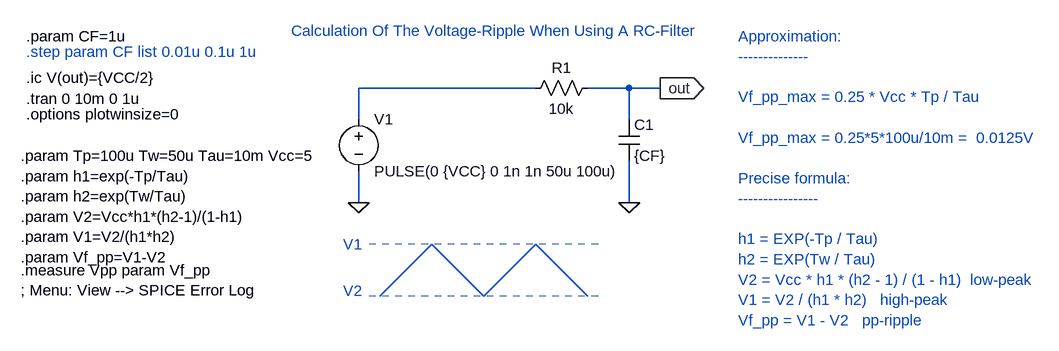
[diagram p0: schematic pwm_RC_filter.asc]
pwm_RC_filter.asc, the LTspice schematic file:
Version 4
SHEET 1 1608 680
WIRE 352 80 80 80
WIRE 496 80 432 80
WIRE 544 80 496 80
WIRE 80 128 80 80
WIRE 496 128 496 80
WIRE 80 256 80 208
WIRE 496 256 496 192
FLAG 496 256 0
FLAG 80 256 0
FLAG 544 80 out
IOPIN 544 80 Out
SYMBOL res 336 96 R270
WINDOW 0 32 56 VTop 0
WINDOW 3 0 56 VBottom 0
SYMATTR InstName R1
SYMATTR Value 10k
SYMBOL cap 480 128 R0
SYMATTR InstName C1
SYMATTR Value {CF}
SYMBOL voltage 80 112 R0
WINDOW 123 0 0 Left 0
WINDOW 39 0 0 Left 0
SYMATTR InstName V1
SYMATTR Value PULSE(0 {VCC} 0 1n 1n 50u 100u)
TEXT -432 96 Left 0 !.tran 0 10m 0 1u
TEXT -432 64 Left 0 !.ic V(out)={VCC/2}
TEXT -432 24 Left 0 ;.step param CF list 0.01u 0.1u 1u
TEXT -432 120 Left 0 !.options plotwinsize=0
TEXT -432 0 Left 0 !.param CF=1u
TEXT 664 0 Left 0 ;Approximation:\n--------------\n \nVf_pp_max = 0.25 * Vcc * Tp / Tau\n \nVf_pp_max = 0.25*5*100u/10m =  0.0125V\n \nPrecise formula:\n----------------\n \nh1 = EXP(-Tp / Tau)\nh2 = EXP(Tw / Tau)\nV2 = Vcc * h1 * (h2 - 1) / (1 - h1)  low-peak\nV1 = V2 / (h1 * h2)   high-peak\nVf_pp = V1 - V2   pp-ripple
TEXT 56 392 Left 0 ;V2
TEXT 56 320 Left 0 ;V1
TEXT -440 184 Left 0 !.param Tp=100u Tw=50u Tau=10m Vcc=5\n.param h1=exp(-Tp/Tau)\n.param h2=exp(Tw/Tau)\n.param V2=Vcc*h1*(h2-1)/(1-h1)\n.param V1=V2/(h1*h2)\n.param Vf_pp=V1-V2
TEXT -24 -8 Left 0 ;Calculation Of The Voltage-Ripple When Using A RC-Filter
TEXT -440 360 Left 0 !.measure Vpp param Vf_pp\n; Menu: View --> SPICE Error Log
LINE Normal 192 320 112 400
LINE Normal 272 400 192 320
LINE Normal 352 320 272 400
LINE Normal 432 400 352 320
LINE Normal 448 320 96 320 2
LINE Normal 448 400 96 400 2

The netlist it stands for:
* pwm_RC_filter.asc
R1 N001 out 10k
C1 out 0 {CF}
V1 N001 0 PULSE(0 {VCC} 0 1n 1n 50u 100u)
.tran 0 10m 0 1u
.ic V(out)={VCC/2}
* .step param CF list 0.01u 0.1u 1u
.options plotwinsize=0
.param CF=1u
* Approximation:
* --------------
* Vf_pp_max = 0.25 * Vcc * Tp / Tau
* Vf_pp_max = 0.25*5*100u/10m =  0.0125V
* Precise formula:
* ----------------
* h1 = EXP(-Tp / Tau)
* h2 = EXP(Tw / Tau)
* V2 = Vcc * h1 * (h2 - 1) / (1 - h1)  low-peak
* V1 = V2 / (h1 * h2)   high-peak
* Vf_pp = V1 - V2   pp-ripple
* V2
* V1
.param Tp=100u Tw=50u Tau=10m Vcc=5
.param h1=exp(-Tp/Tau)
.param h2=exp(Tw/Tau)
.param V2=Vcc*h1*(h2-1)/(1-h1)
.param V1=V2/(h1*h2)
.param Vf_pp=V1-V2
* Calculation Of The Voltage-Ripple When Using A RC-Filter
.measure Vpp param Vf_pp
; Menu: View --> SPICE Error Log
.backanno
.end